# Altium schematic sheet Block Diagram.SchDoc: B302AA Block Diagram
size 292 x 193 mm; SheetNumber: 1; SheetTotal: 11
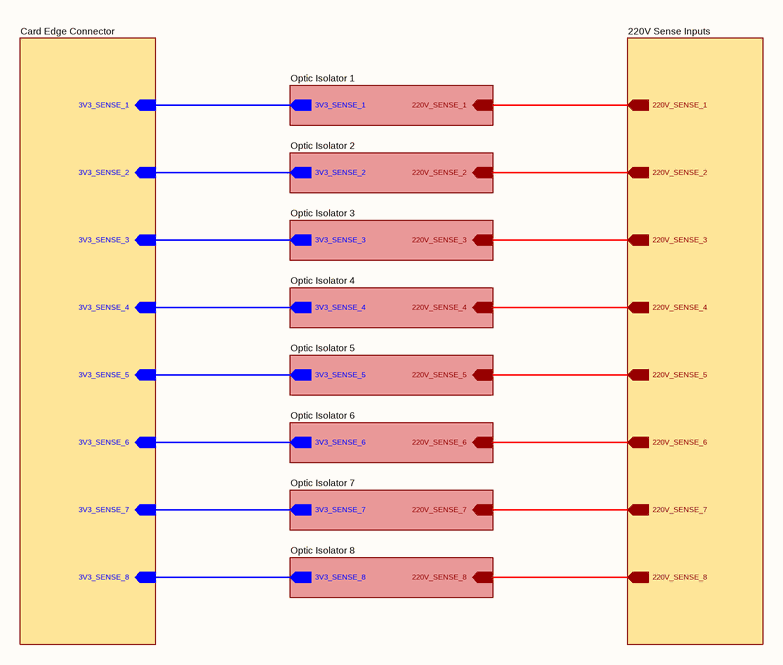
[diagram p0: Block Diagram.SchDoc]

## Sub-sheets
220V Sense Inputs = 220V Sense Input Socket.SchDoc: 220V_SENSE_2 (out), 220V_SENSE_1 (out), 220V_SENSE_5 (out), 220V_SENSE_6 (out), 220V_SENSE_3 (out), 220V_SENSE_4 (out), 220V_SENSE_7 (out), 220V_SENSE_8 (out)
Card Edge Connector = Card Edge Connector.SchDoc: 3V3_SENSE_1 (in), 3V3_SENSE_2 (in), 3V3_SENSE_3 (in), 3V3_SENSE_4 (in), 3V3_SENSE_5 (in), 3V3_SENSE_6 (in), 3V3_SENSE_8 (in), 3V3_SENSE_7 (in)
Optic Isolator 1 = Opto Isolator 1.SchDoc: 220V_SENSE_1 (in), 3V3_SENSE_1 (out)
Optic Isolator 2 = Opto Isolator 2.SchDoc: 220V_SENSE_2 (in), 3V3_SENSE_2 (out)
Optic Isolator 3 = Opto Isolator 3.SchDoc: 220V_SENSE_3 (in), 3V3_SENSE_3 (out)
Optic Isolator 4 = Opto Isolator 4.SchDoc: 220V_SENSE_4 (in), 3V3_SENSE_4 (out)
Optic Isolator 5 = Opto Isolator 5.SchDoc: 220V_SENSE_5 (in), 3V3_SENSE_5 (out)
Optic Isolator 6 = Opto Isolator 6.SchDoc: 220V_SENSE_6 (in), 3V3_SENSE_6 (out)
Optic Isolator 7 = Opto Isolator 7.SchDoc: 220V_SENSE_7 (in), 3V3_SENSE_7 (out)
Optic Isolator 8 = Opto Isolator 8.SchDoc: 220V_SENSE_8 (in), 3V3_SENSE_8 (out)

## Nets
(unnamed): sheet 220V Sense Inputs/220V_SENSE_2, sheet Optic Isolator 2/220V_SENSE_2
(unnamed): sheet 220V Sense Inputs/220V_SENSE_1, sheet Optic Isolator 1/220V_SENSE_1
(unnamed): sheet 220V Sense Inputs/220V_SENSE_5, sheet Optic Isolator 5/220V_SENSE_5
(unnamed): sheet 220V Sense Inputs/220V_SENSE_6, sheet Optic Isolator 6/220V_SENSE_6
(unnamed): sheet 220V Sense Inputs/220V_SENSE_3, sheet Optic Isolator 3/220V_SENSE_3
(unnamed): sheet 220V Sense Inputs/220V_SENSE_4, sheet Optic Isolator 4/220V_SENSE_4
(unnamed): sheet 220V Sense Inputs/220V_SENSE_7, sheet Optic Isolator 7/220V_SENSE_7
(unnamed): sheet 220V Sense Inputs/220V_SENSE_8, sheet Optic Isolator 8/220V_SENSE_8
(unnamed): sheet Optic Isolator 1/3V3_SENSE_1, sheet Card Edge Connector/3V3_SENSE_1
(unnamed): sheet Card Edge Connector/3V3_SENSE_2, sheet Optic Isolator 2/3V3_SENSE_2
(unnamed): sheet Card Edge Connector/3V3_SENSE_3, sheet Optic Isolator 3/3V3_SENSE_3
(unnamed): sheet Card Edge Connector/3V3_SENSE_4, sheet Optic Isolator 4/3V3_SENSE_4
(unnamed): sheet Card Edge Connector/3V3_SENSE_5, sheet Optic Isolator 5/3V3_SENSE_5
(unnamed): sheet Card Edge Connector/3V3_SENSE_6, sheet Optic Isolator 6/3V3_SENSE_6
(unnamed): sheet Card Edge Connector/3V3_SENSE_8, sheet Optic Isolator 8/3V3_SENSE_8
(unnamed): sheet Card Edge Connector/3V3_SENSE_7, sheet Optic Isolator 7/3V3_SENSE_7

## Notes on the sheet
- © 2021 All rights reserved.
  This document may not, in whole or in part, be copied, photocopied, reproduced, translated or converted to any electronic or machine readable from without prior written permission of Mehmet Günce Akkoyun.
  Engineer contact : akkoyun@me.com
- Property of
- Engineer :
- Date :
- Size :
- A4
- Time :
- Project :
- Page :
- /
- Customer :
- Product ID :
- Module ID :
- Version :
- File :
- Revision :